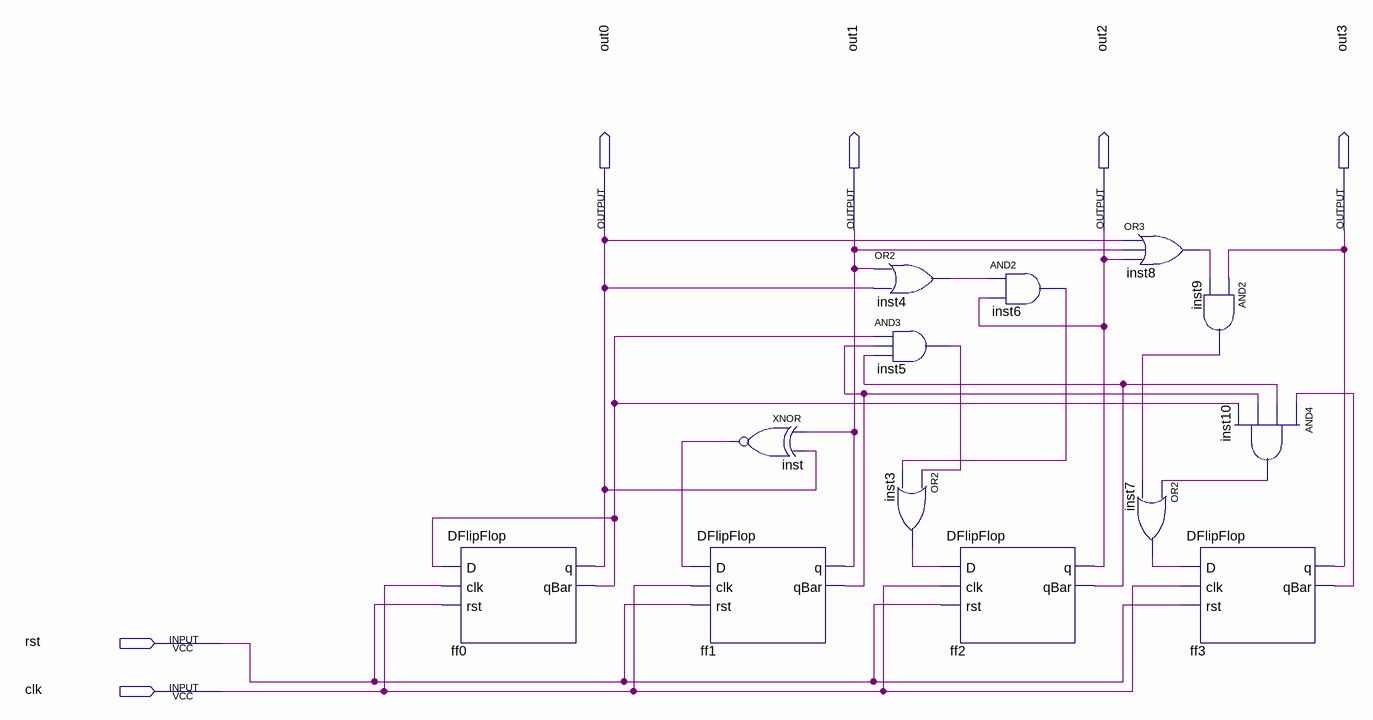
[diagram p0: schematic sheet]
// Quartus schematic SynchDownSchematic.bdf as structural Verilog: 13 symbols, 6 pins
module SynchDownSchematic (
  input  rst,
  input  clk,
  output out0,
  output out1,
  output out2,
  output out3
);

  wire ff0_qbar, ff1_qbar, ff2_qbar, ff3_qbar, inst3_out, inst4_out, inst5_out, inst6_out, inst7_out,
       inst8_out, inst9_out, inst10_out, inst_out;

  DFlipFlop ff0 (.D(ff0_qbar), .clk(clk), .rst(rst), .q(out0), .qBar(ff0_qbar));
  xnor inst (inst_out, out1, out0);
  DFlipFlop ff1 (.D(inst_out), .clk(clk), .rst(rst), .q(out1), .qBar(ff1_qbar));
  or inst4 (inst4_out, out1, out0);
  and inst5 (inst5_out, ff0_qbar, ff1_qbar, ff2_qbar);
  or inst3 (inst3_out, inst5_out, inst6_out);
  DFlipFlop ff2 (.D(inst3_out), .clk(clk), .rst(rst), .q(out2), .qBar(ff2_qbar));
  and inst6 (inst6_out, inst4_out, out2);
  or inst8 (inst8_out, out0, out1, out2);
  or inst7 (inst7_out, inst10_out, inst9_out);
  and inst9 (inst9_out, out3, inst8_out);
  DFlipFlop ff3 (.D(inst7_out), .clk(clk), .rst(rst), .q(out3), .qBar(ff3_qbar));
  and inst10 (inst10_out, ff3_qbar, ff2_qbar, ff1_qbar, ff0_qbar);
endmodule
